# Altium schematic sheet ZHSD-Power-Decoupling.SchDoc
size A3; SheetNumber: 3; SheetTotal: 8
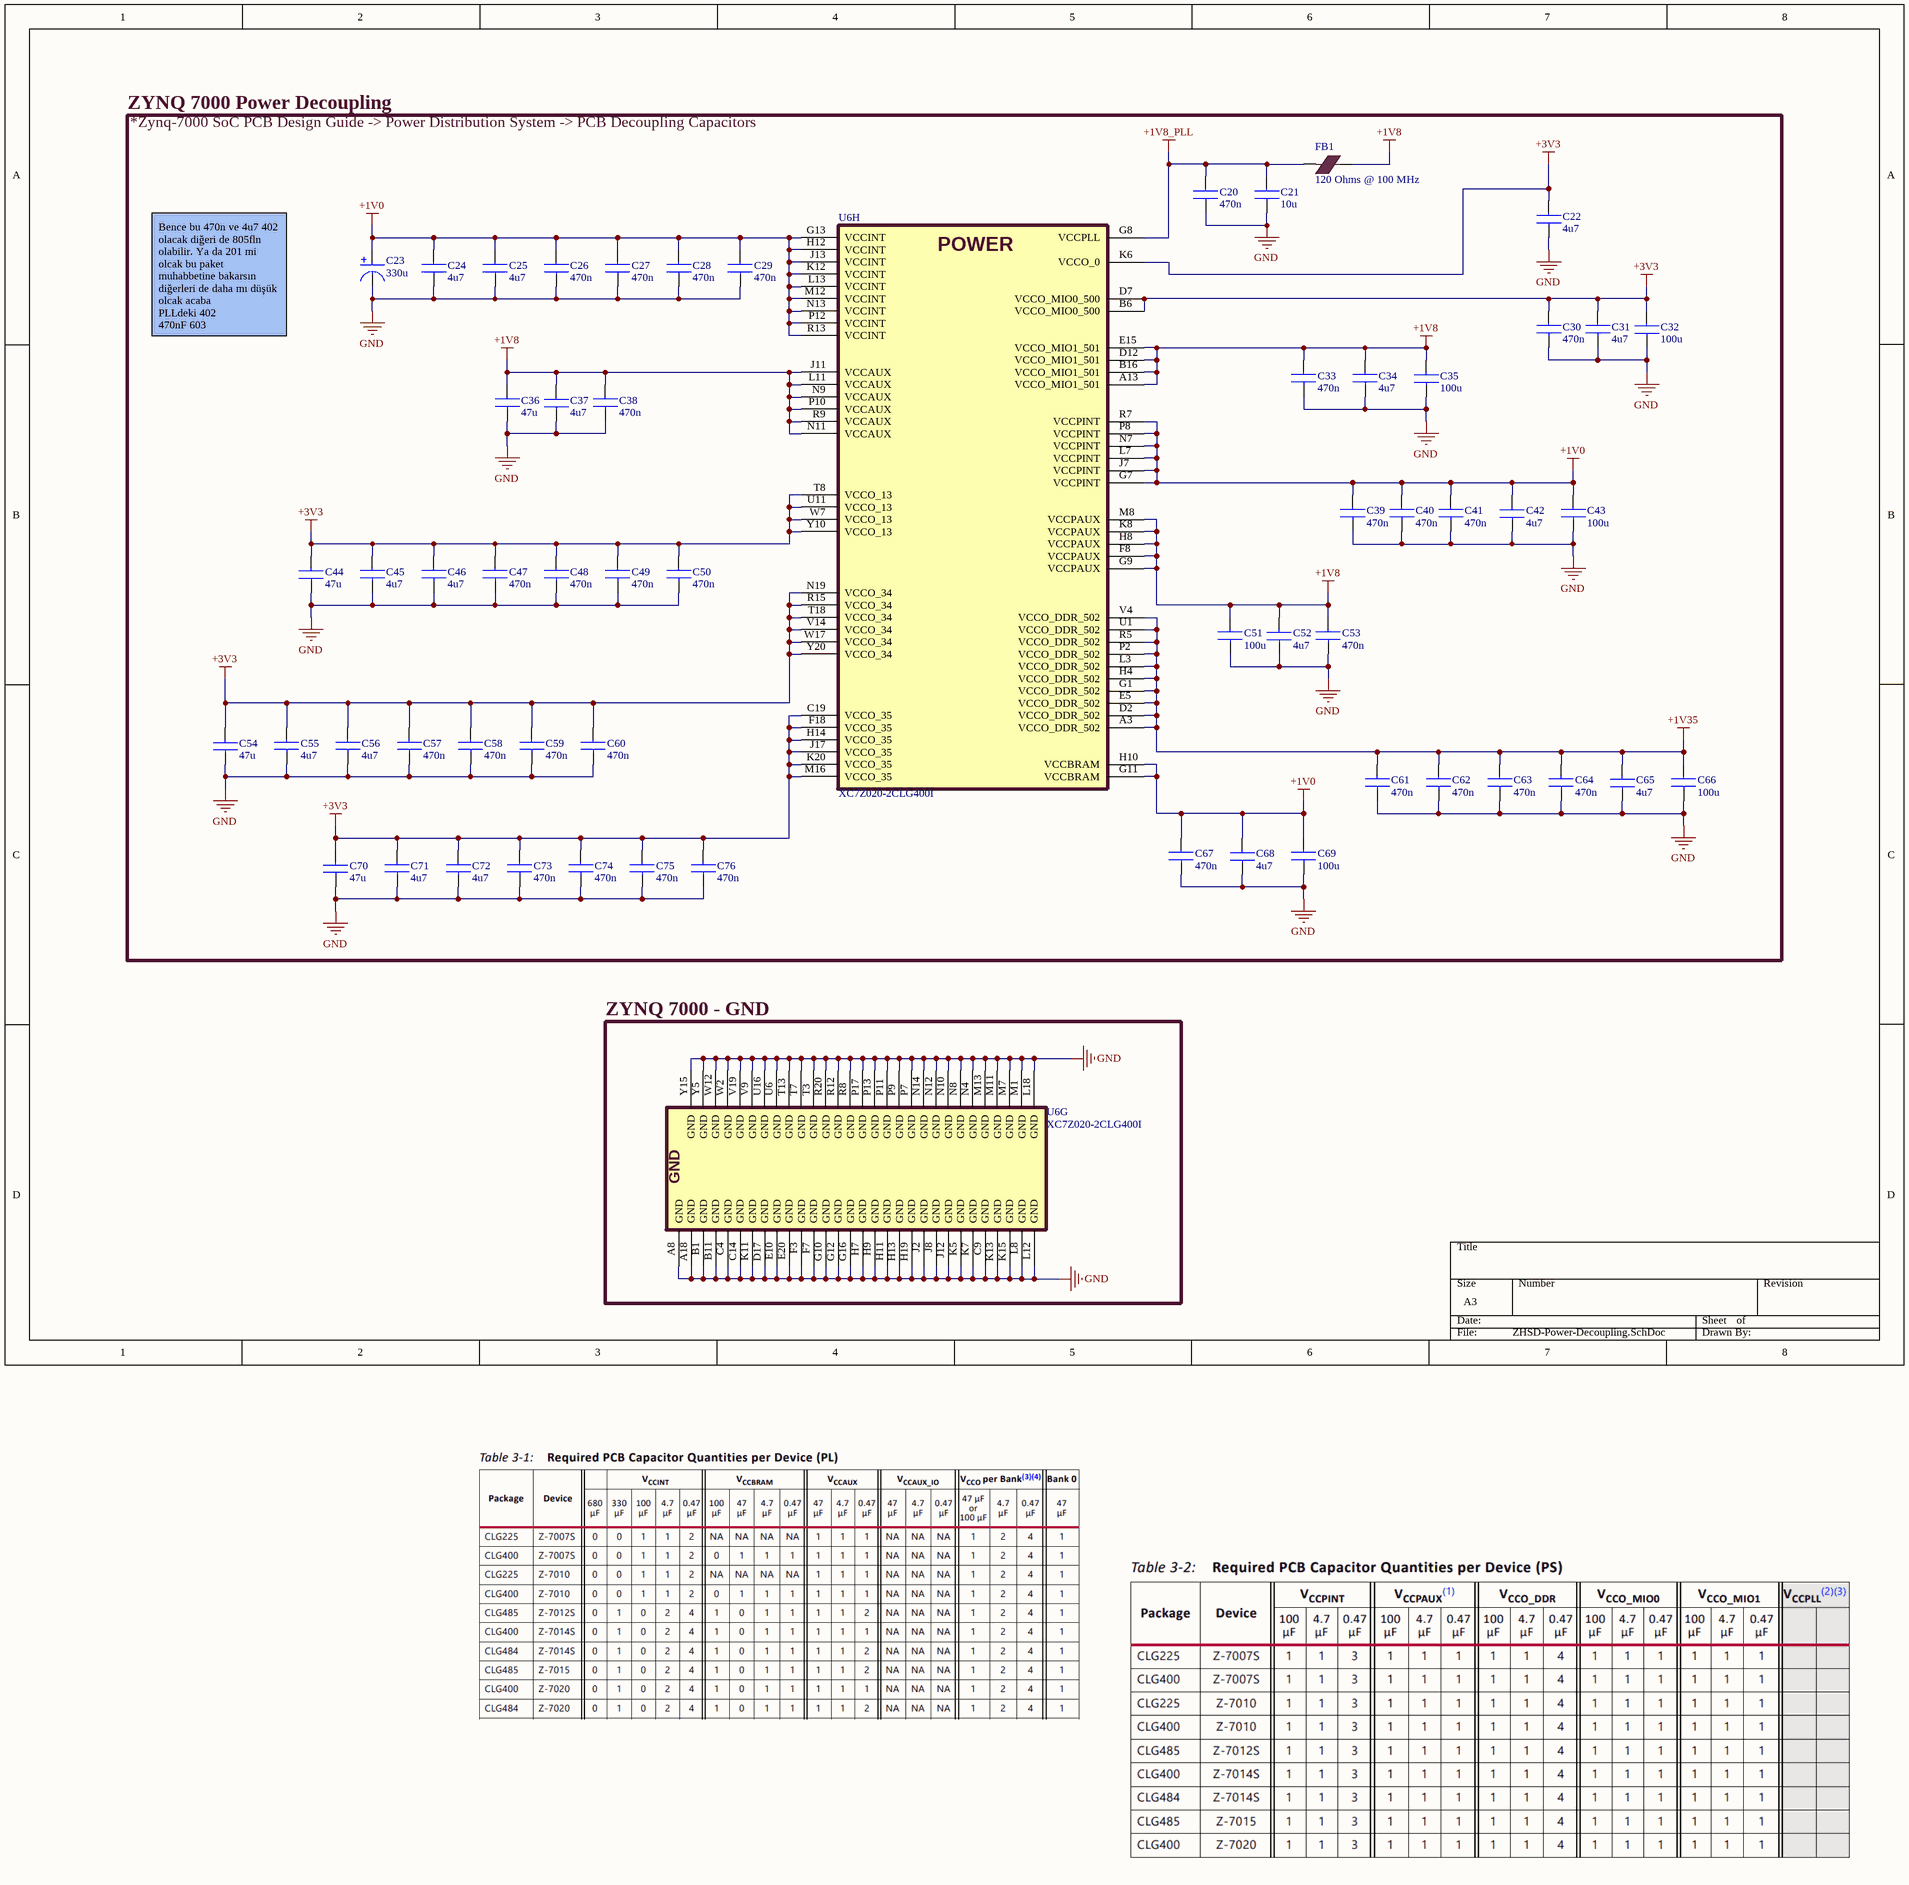
[diagram p0: ZHSD-Power-Decoupling.SchDoc]

## Parts
C20  470n  [0402CAPC1005X06N]
C21  10u  [0603CAPC1608X09N]
C22  4u7  [0805CAPC2012X14N]
C23  330u  [T525D337M006ATE025]
C24  4u7  [0805CAPC2012X14N]
C25  4u7  [0805CAPC2012X14N]
C26  470n  [0402CAPC1005X06N]
C27  470n  [0402CAPC1005X06N]
C28  470n  [0402CAPC1005X06N]
C29  470n  [0402CAPC1005X06N]
C30  470n  [0402CAPC1005X06N]
C31  4u7  [0805CAPC2012X14N]
C32  100u  [1210CAPC3225X27N]
C33  470n  [0402CAPC1005X06N]
C34  4u7  [0805CAPC2012X14N]
C35  100u  [1210CAPC3225X27N]
C36  47u  [1210CAPC3225X27N]
C37  4u7  [0805CAPC2012X14N]
C38  470n  [0402CAPC1005X06N]
C39  470n  [0402CAPC1005X06N]
C40  470n  [0402CAPC1005X06N]
C41  470n  [0603CAPC1608X09N]
C42  4u7  [0805CAPC2012X14N]
C43  100u  [1210CAPC3225X27N]
C44  47u  [1210CAPC3225X27N]
C45  4u7  [0805CAPC2012X14N]
C46  4u7  [0805CAPC2012X14N]
C47  470n  [0402CAPC1005X06N]
C48  470n  [0402CAPC1005X06N]
C49  470n  [0402CAPC1005X06N]
C50  470n  [0402CAPC1005X06N]
C51  100u  [1210CAPC3225X27N]
C52  4u7  [0805CAPC2012X14N]
C53  470n  [0402CAPC1005X06N]
C54  47u  [1210CAPC3225X27N]
C55  4u7  [0805CAPC2012X14N]
C56  4u7  [0805CAPC2012X14N]
C57  470n  [0402CAPC1005X06N]
C58  470n  [0402CAPC1005X06N]
C59  470n  [0402CAPC1005X06N]
C60  470n  [0402CAPC1005X06N]
C61  470n  [0402CAPC1005X06N]
C62  470n  [0402CAPC1005X06N]
C63  470n  [0402CAPC1005X06N]
C64  470n  [0402CAPC1005X06N]
C65  4u7  [0805CAPC2012X14N]
C66  100u  [1210CAPC3225X27N]
C67  470n  [0402CAPC1005X06N]
C68  4u7  [0805CAPC2012X14N]
C69  100u  [1210CAPC3225X27N]
C70  47u  [1210CAPC3225X27N]
C71  4u7  [0805CAPC2012X14N]
C72  4u7  [0805CAPC2012X14N]
C73  470n  [0402CAPC1005X06N]
C74  470n  [0402CAPC1005X06N]
C75  470n  [0402CAPC1005X06N]
C76  470n  [0402CAPC1005X06N]
FB1  120 Ohms @ 100 MHz  [0603INDC1608X08N]
U6  XC7Z020-2CLG400I  [BGA400C80P20X20_1700X1700X147]  (parts G,H of 8)

## Blocks framed on the sheet
ZYNQ 7000 Power Decoupling: C20-C76 FB1 U6
ZYNQ 7000 - GND: U6

## Nets
+1V0: C23.1 C24.2 C25.2 C26.2 C27.2 C28.2 C29.2 C39.2 C40.2 C41.2 C42.2 C43.1 C67.2 C68.2 C69.1 U6.G7(VCCPINT) U6.G11(VCCBRAM) U6.G13(VCCINT) U6.H10(VCCBRAM) U6.H12(VCCINT) U6.J7(VCCPINT) U6.J13(VCCINT) U6.K12(VCCINT) U6.L7(VCCPINT) U6.L13(VCCINT) U6.M12(VCCINT) U6.N7(VCCPINT) U6.N13(VCCINT) U6.P8(VCCPINT) U6.P12(VCCINT) U6.R7(VCCPINT) U6.R13(VCCINT)
+1V8: C33.2 C34.2 C35.1 C36.2 C37.2 C38.2 C51.1 C52.2 C53.2 FB1.2 U6.A13(VCCO_MIO1_501) U6.B16(VCCO_MIO1_501) U6.D12(VCCO_MIO1_501) U6.E15(VCCO_MIO1_501) U6.F8(VCCPAUX) U6.G9(VCCPAUX) U6.H8(VCCPAUX) U6.J11(VCCAUX) U6.K8(VCCPAUX) U6.L11(VCCAUX) U6.M8(VCCPAUX) U6.N9(VCCAUX) U6.N11(VCCAUX) U6.P10(VCCAUX) U6.R9(VCCAUX)
+1V8_PLL: C20.2 C21.2 FB1.1 U6.G8(VCCPLL)
+1V35: C61.2 C62.2 C63.2 C64.2 C65.2 C66.1 U6.A3(VCCO_DDR_502) U6.D2(VCCO_DDR_502) U6.E5(VCCO_DDR_502) U6.G1(VCCO_DDR_502) U6.H4(VCCO_DDR_502) U6.L3(VCCO_DDR_502) U6.P2(VCCO_DDR_502) U6.R5(VCCO_DDR_502) U6.U1(VCCO_DDR_502) U6.V4(VCCO_DDR_502)
+3V3: C22.2 C30.2 C31.2 C32.1 C44.2 C45.2 C46.2 C47.2 C48.2 C49.2 C50.2 C54.2 C55.2 C56.2 C57.2 C58.2 C59.2 C60.2 C70.2 C71.2 C72.2 C73.2 C74.2 C75.2 C76.2 U6.B6(VCCO_MIO0_500) U6.C19(VCCO_35) U6.D7(VCCO_MIO0_500) U6.F18(VCCO_35) U6.H14(VCCO_35) U6.J17(VCCO_35) U6.K6(VCCO_0) U6.K20(VCCO_35) U6.M16(VCCO_35) U6.N19(VCCO_34) U6.R15(VCCO_34) U6.T8(VCCO_13) U6.T18(VCCO_34) U6.U11(VCCO_13) U6.V14(VCCO_34) U6.W7(VCCO_13) U6.W17(VCCO_34) U6.Y10(VCCO_13) U6.Y20(VCCO_34)
GND: C20.1 C21.1 C22.1 C23.2 C24.1 C25.1 C26.1 C27.1 C28.1 C29.1 C30.1 C31.1 C32.2 C33.1 C34.1 C35.2 C36.1 C37.1 C38.1 C39.1 C40.1 C41.1 C42.1 C43.2 C44.1 C45.1 C46.1 C47.1 C48.1 C49.1 C50.1 C51.2 C52.1 C53.1 C54.1 C55.1 C56.1 C57.1 C58.1 C59.1 C60.1 C61.1 C62.1 C63.1 C64.1 C65.1 C66.2 C67.1 C68.1 C69.2 C70.1 C71.1 C72.1 C73.1 C74.1 C75.1 C76.1 U6.A8(GND) U6.A18(GND) U6.B1(GND) U6.B11(GND) U6.C4(GND) U6.C9(GND) U6.C14(GND) U6.D17(GND) U6.E10(GND) U6.E20(GND) U6.F3(GND) U6.F7(GND) U6.G10(GND) U6.G12(GND) U6.G16(GND) U6.H7(GND) U6.H9(GND) U6.H11(GND) U6.H13(GND) U6.H19(GND) U6.J2(GND) U6.J8(GND) U6.J12(GND) U6.K5(GND) U6.K7(GND) U6.K11(GND) U6.K13(GND) U6.K15(GND) U6.L8(GND) U6.L12(GND) U6.L18(GND) U6.M1(GND) U6.M7(GND) U6.M11(GND) U6.M13(GND) U6.N4(GND) U6.N8(GND) U6.N10(GND) U6.N12(GND) U6.N14(GND) U6.P7(GND) U6.P9(GND) U6.P11(GND) U6.P13(GND) U6.P17(GND) U6.R8(GND) U6.R12(GND) U6.R20(GND) U6.T3(GND) U6.T7(GND) U6.T13(GND) U6.U6(GND) U6.U16(GND) U6.V9(GND) U6.V19(GND) U6.W2(GND) U6.W12(GND) U6.Y5(GND) U6.Y15(GND)

## Notes on the sheet
- *Zynq-7000 SoC PCB Design Guide -> Power Distribution System -> PCB Decoupling Capacitors
- Bence bu 470n ve 4u7 402 olacak diğeri de 805fln olabilir. Ya da 201 mi olcak bu paket muhabbetine bakarsın diğerleri de daha mı düşük olcak acaba
  PLLdeki 402
  470nF 603
  4u7 805
  47u&100u 1210
  330u Tant 2817
  Check Table 3-3 and PCB High-Frequency Capacitors section to substitute caps
- (in symbol XC7Z020-2CLG400I, part H) POWER

## Library data of the parts
C20 C26-C30 C33 C38-C40 C47-C50 C53 C57-C64 C67 C73-C76 = GRM155R60J474KE19D: CAP CER 0.47UF 6.3V X5R 0402(1005) ±10%; Manufacturer: Murata Electronics; Value: 0.47 µF; ComponentLink1Description: Datasheet; ComponentLink1URL: https://search.murata.co.jp/Ceramy/image/img/A01X/G101/ENG/GRM21BR71A475KE51-01.pdf; MPN: GRM155R60J474KE19D; Package: 0402; Tolerance: ±10%; Voltage: 6.3V
C21 = GRM188R60G106ME47D: CAP CER 10UF 4V X5R 0603 (1608) ±20%; Manufacturer: Murata Electronics; Value: 10 µF; ComponentLink1Description: Datasheet; ComponentLink1URL: https://search.murata.co.jp/Ceramy/image/img/A01X/G101/ENG/GRM188R60G106ME47-01.pdf; MPN: GRM188R60G106ME47D; Package: 0603; Tolerance: ±20%; Voltage: 4V
C22 C24 C25 C31 C34 C37 C42 C45 C46 C52 C55 C56 C65 C68 C71 C72 = GRM21BR71A475KE51L: CAP CER 4.7UF 10V X7R 0805 (2012) ±10%; Manufacturer: Murata Electronics; Value: 4.7 µF; ComponentLink1Description: Datasheet; ComponentLink1URL: https://search.murata.co.jp/Ceramy/image/img/A01X/G101/ENG/GRM21BR71A475KE51-01.pdf; MPN: GRM21BR71A475KE51L; Package: 0805; Tolerance: ±10%; Voltage: 10V
C23 = T525D337M006ATE025: CAP TANT POLY 330UF 6.3V 2917 (7343) ±20%; Manufacturer: KEMET; ESR: 25mOhm @ 100kHz; Value: 330 µF; ComponentLink1Description: Datasheet; ComponentLink1URL: https://search.kemet.com/download/specsheet/T525D337M006ATE025; MPN: T525D337M006ATE025; Package: 2917; Tolerance: ±20%; Voltage: 6.3 V
C32 C35 C43 C51 C66 C69 = GRM32EE70G107ME19L: CAP CER 100UF 4V X7U 1210 (3225) ±20%; Manufacturer: Murata Electronics; Value: 100 µF; ComponentLink1Description: Datasheet; ComponentLink1URL: https://search.murata.co.jp/Ceramy/image/img/A01X/G101/ENG/GRM32EE70G107ME19-01.pdf; MPN: GRM32EE70G107ME19L; Package: 1210; Tolerance: ±20%; Voltage: 4V
C36 C44 C54 C70 = GRM32ER70J476ME20L: CAP CER 47UF 6.3V X7R 1210 1210 (3225) ±20%; Manufacturer: Murata Electronics; Value: 47 µF; ComponentLink1Description: Datasheet; ComponentLink1URL: https://search.murata.co.jp/Ceramy/image/img/A01X/G101/ENG/GRM32ER70J476ME20-01.pdf; MPN: GRM32ER70J476ME20L; Package: 1210; Tolerance: ±20%; Voltage: 6.3V
C41 = GRM188R70J474KA01D: CAP CER 0.47UF 6.3V X7R 0603 (1608) ±10%; Manufacturer: Murata Electronics; Value: 0.47 µF; ComponentLink1Description: Datasheet; ComponentLink1URL: https://search.murata.co.jp/Ceramy/image/img/A01X/G101/ENG/GRM188R70J474KA01-01.pdf; MPN: GRM188R70J474KA01D; Package: 0603; Tolerance: ±10%; Voltage: 6.3V
FB1 = BLM18SG121TN1D: FERRITE BEAD 120 OHM 0603 (1608) 3A 25mOhm; Manufacturer: Murata Electronics; ComponentLink1Description: Datasheet; ComponentLink1URL: https://pim.murata.com/asset/pim4/ferriteBeadInductortypefilter/ENFA0003_PDF_FERRITEBEADINDUCTORTYPEFILTER?lastModifiedDatetime=20250707190934; ComponentLink2Description: Website; ComponentLink2URL: https://pim.murata.com/en-global/pim/details/?partNum=BLM18SG121TN1%23; Current Rating (Max): 3A; DC Resistance (DCR) (Max): 25mOhm; Impedance @ Frequency: 120 Ohms @ 100 MHz; MPN: BLM18SG121TN1D; Package: 0603
U6 = XC7Z020-2CLG400I: Dual ARM® Cortex®-A9 MPCore™ with CoreSight™ System On Chip (SOC) IC Zynq®-7000 Artix™-7 FPGA, 85K Logic Cells 766MHz 400-CSPBGA (17x17); Manufacturer: AMD/XILINX; MPN: XC7Z020-2CLG400I; ComponentLink1Description: Datasheet; ComponentLink1URL: https://docs.amd.com/v/u/en-US/ds190-Zynq-7000-Overview; ComponentLink2Description: DC and AC Switching Characteristics; ComponentLink2URL: https://docs.amd.com/v/u/en-US/ds187-XC7Z010-XC7Z020-Data-Sheet; ComponentLink3Description: PCB Design Guide; ComponentLink3URL: https://docs.amd.com/v/u/en-US/ug933-Zynq-7000-PCB; ComponentLink4Description: Packaging and Pinout; ComponentLink4URL: https://docs.amd.com/v/u/en-US/ug865-Zynq-7000-Pkg-Pinout; ComponentLink5Description: Zynq 7000 SoC Technical Reference Manual; ComponentLink5URL: https://docs.amd.com/r/en-US/ug585-zynq-7000-SoC-TRM